# EAGLE design ESP32_Sparrow_rev2 (EAGLE 9.6.2)
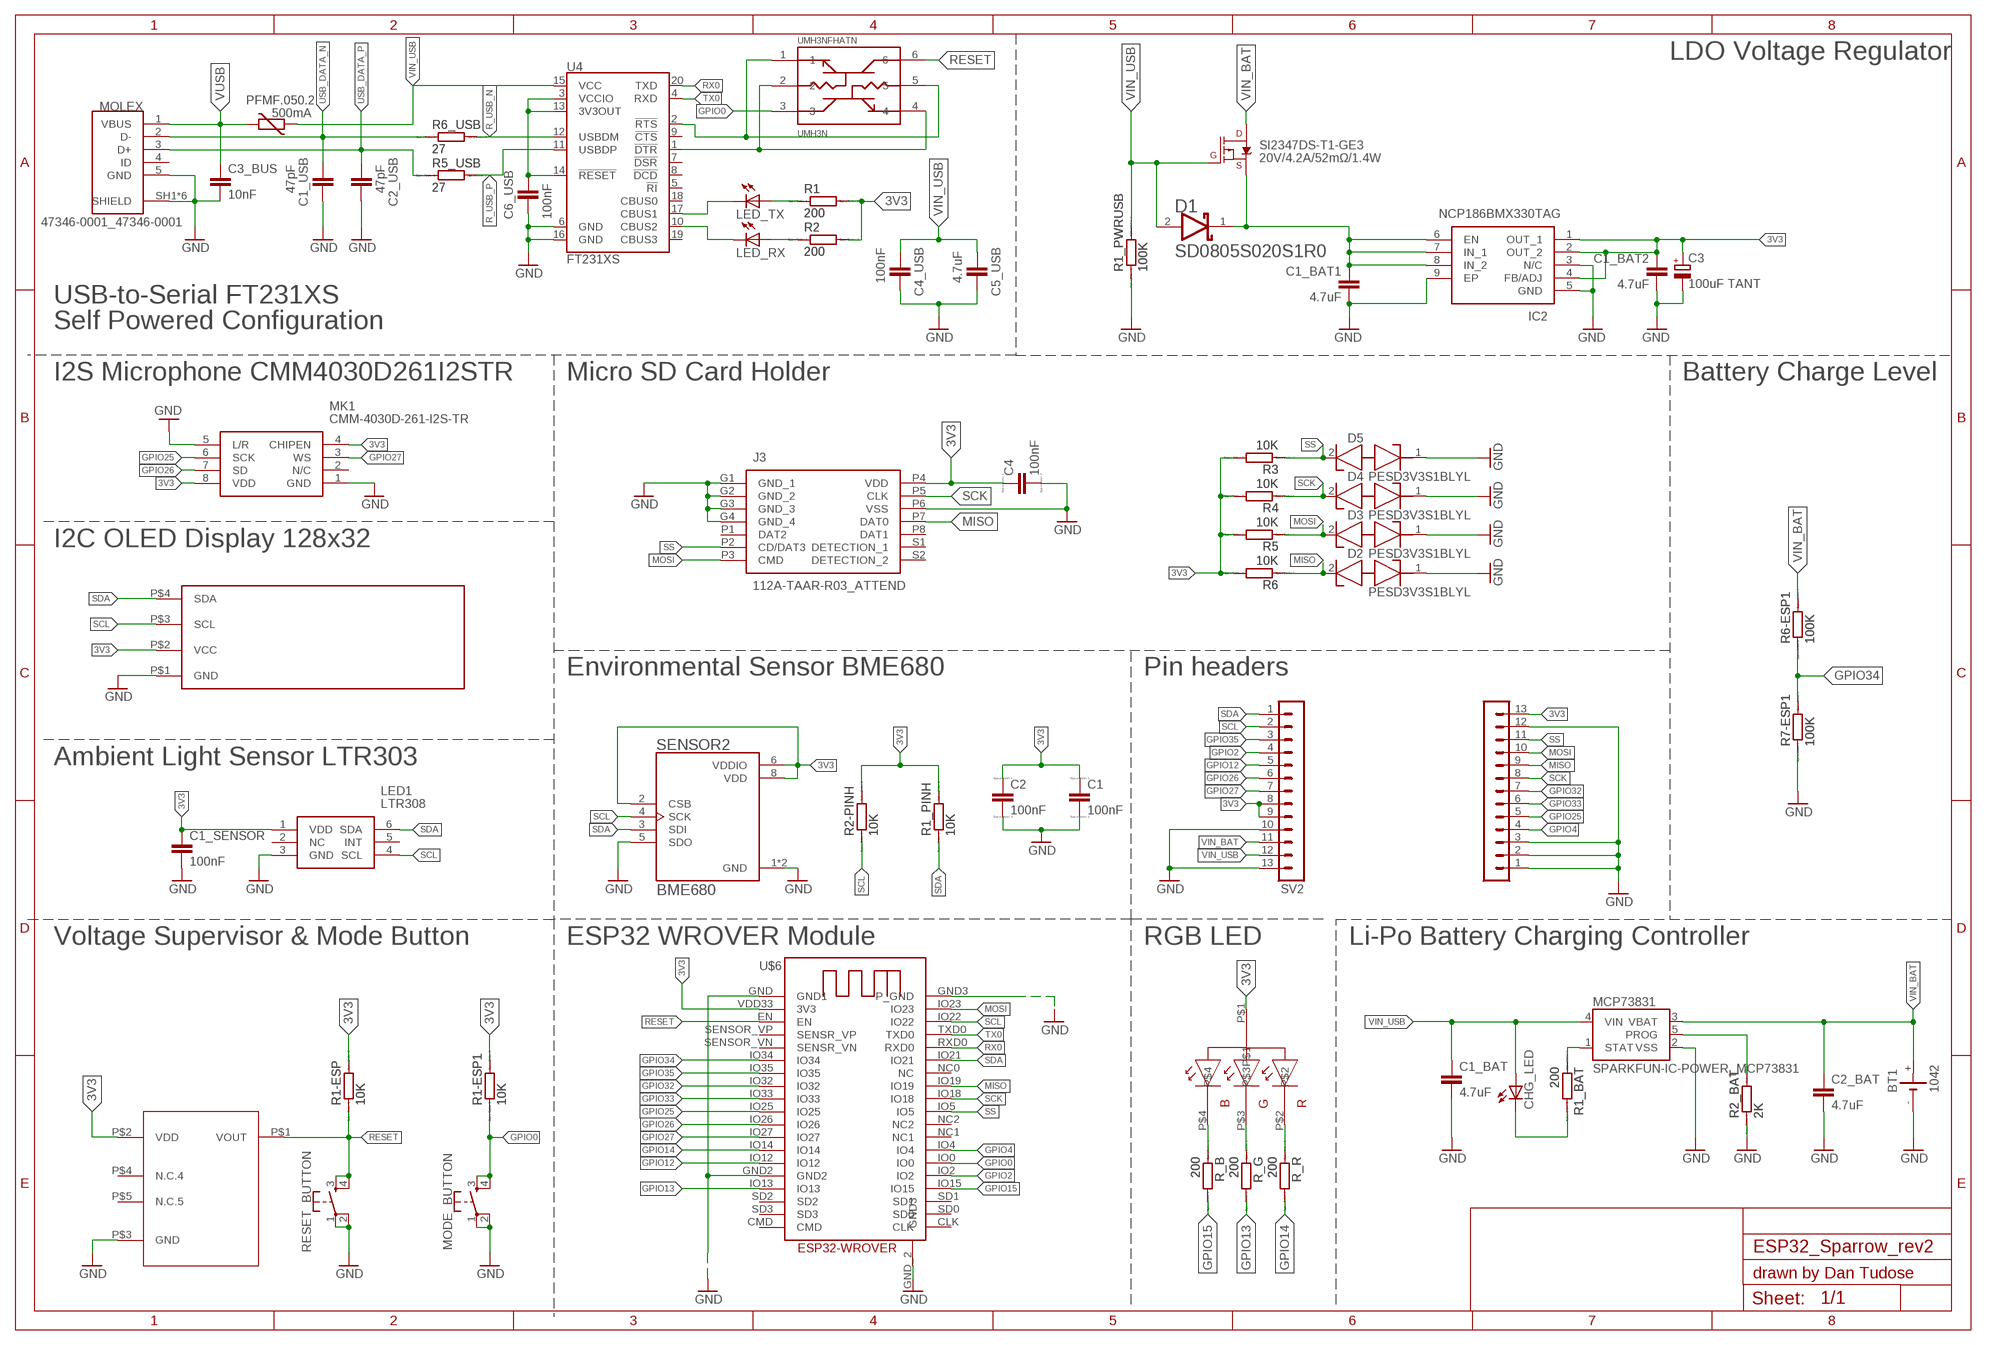
[diagram p0: schematic, sheet 1]

## Parts
BD48E27G-TR  BD48E27G-TR_BD48E27G-TR  [BD48E27G-TR_SSOP5]
BT1  1042  [BAT_1042]
C1  100nF  EAGLE-LTSPICE_CC0402  [EAGLE-LTSPICE_C0402]
C1_BAT  4.7uF  RCL_C-EUC0603  [RCL_C0603]
C1_BAT1  4.7uF  RCL_C-EUC0603  [RCL_C0603]
C1_BAT2  4.7uF  RCL_C-EUC0603  [RCL_C0603]
C1_SENSOR  100nF  RCL_C-EUC0603  [RCL_C0603]
C1_USB  47pF  RCL_C-EUC0603  [RCL_C0603]
C2  100nF  EAGLE-LTSPICE_CC0402  [EAGLE-LTSPICE_C0402]
C2_BAT  4.7uF  RCL_C-EUC0603  [RCL_C0603]
C2_USB  47pF  RCL_C-EUC0603  [RCL_C0603]
C3  100uF TANT  CPOL-EUCT3528  [CT3528]
C3_BUS  10nF  RCL_C-EUC0603  [RCL_C0603]
C4  100nF  EAGLE-LTSPICE_CC0402  [EAGLE-LTSPICE_C0402]
C4_USB  100nF  RCL_C-EUC0603  [RCL_C0603]
C5_USB  4.7uF  RCL_C-EUC0603  [RCL_C0603]
C6_USB  100nF  RCL_C-EUC0603  [RCL_C0603]
CHG_LED  ADAFRUIT_LEDCHIP-LED0603  [ADAFRUIT_CHIP-LED0603]
D1  AVX---SD0805S020S1R0_AVX_SD0805S020S1R0AVX_SD0805S020S1R0_0_0  [AVX---SD0805S020S1R0_AVX_SD0805S020S1R0_0]
D2  PESD3V3S1BLYL  [PESD5V0S1BL315]
D3  PESD3V3S1BLYL  [PESD5V0S1BL315]
D4  PESD3V3S1BLYL  [PESD5V0S1BL315]
D5  PESD3V3S1BLYL  [PESD5V0S1BL315]
IC2  NCP186BMX330TAG  [NCP186AMX330TAG]
J3  112A-TAAR-R03_ATTEND  [112ATAARR03ATTEND]
LED1  LTR308  SAMACSYS_PARTS_LTR-303ALS-01  [SAMACSYS_PARTS_LTR303ALS01]
LED_RX  ADAFRUIT_LEDCHIP-LED0603  [ADAFRUIT_CHIP-LED0603]
LED_TX  ADAFRUIT_LEDCHIP-LED0603  [ADAFRUIT_CHIP-LED0603]
MCP73831  SPARKFUN-IC-POWER_MCP73831  [SPARKFUN-IC-POWER_SOT23-5]
MK1  CMM-4030D-261-I2S-TR  [CMM4030D261I2STR]
MODE_BUTTON  SPARKFUN-SWITCHES_MOMENTARY-SWITCH-SPST-2-SMD-4.6X2.8MM  [SPARKFUN-SWITCHES_TACTILE_SWITCH_SMD_4.6X2.8MM]
MOLEX  47346-0001_47346-0001  [47346-0001_MOLEX_47346-0001]
PFMF.050.2  500mA  VARISTOR_VARISTORCN1812  [VARISTOR_CT/CN1812]
R1  200  EAGLE-LTSPICE_RR0402  [EAGLE-LTSPICE_R0402]
R1-ESP  10K  EAGLE-LTSPICE_RR0402  [EAGLE-LTSPICE_R0402]
R1-ESP1  10K  EAGLE-LTSPICE_RR0402  [EAGLE-LTSPICE_R0402]
R1_BAT  200  EAGLE-LTSPICE_RR0402  [EAGLE-LTSPICE_R0402]
R1_PINH  10K  EAGLE-LTSPICE_RR0402  [EAGLE-LTSPICE_R0402]
R1_PWRUSB  100K  EAGLE-LTSPICE_RR0402  [EAGLE-LTSPICE_R0402]
R2  200  EAGLE-LTSPICE_RR0402  [EAGLE-LTSPICE_R0402]
R2-PINH  10K  EAGLE-LTSPICE_RR0402  [EAGLE-LTSPICE_R0402]
R2_BAT  2K  EAGLE-LTSPICE_RR0402  [EAGLE-LTSPICE_R0402]
R3  10K  EAGLE-LTSPICE_RR0402  [EAGLE-LTSPICE_R0402]
R4  10K  EAGLE-LTSPICE_RR0402  [EAGLE-LTSPICE_R0402]
R5  10K  EAGLE-LTSPICE_RR0402  [EAGLE-LTSPICE_R0402]
R5_USB  27  EAGLE-LTSPICE_RR0402  [EAGLE-LTSPICE_R0402]
R6  10K  EAGLE-LTSPICE_RR0402  [EAGLE-LTSPICE_R0402]
R6-ESP1  100K  EAGLE-LTSPICE_RR0402  [EAGLE-LTSPICE_R0402]
R6_USB  27  EAGLE-LTSPICE_RR0402  [EAGLE-LTSPICE_R0402]
R7-ESP1  100K  EAGLE-LTSPICE_RR0402  [EAGLE-LTSPICE_R0402]
R_B  200  EAGLE-LTSPICE_RR0402  [EAGLE-LTSPICE_R0402]
R_G  200  EAGLE-LTSPICE_RR0402  [EAGLE-LTSPICE_R0402]
R_R  200  EAGLE-LTSPICE_RR0402  [EAGLE-LTSPICE_R0402]
RESET_BUTTON  SPARKFUN-SWITCHES_MOMENTARY-SWITCH-SPST-2-SMD-4.6X2.8MM  [SPARKFUN-SWITCHES_TACTILE_SWITCH_SMD_4.6X2.8MM]
SENSOR2  BME680  BME680_BME680  [BME680_PSON80P300X300X100-8N]
SI2347DS-T1-GE3  20V/4.2A/52mΩ/1.4W  SPARKFUN-DISCRETESEMI_MOSFET_PCH-DMG2305UX-7  [SPARKFUN-DISCRETESEMI_SOT23-3]
SV1  MA13-1  [MA13-1]
SV2  MA13-1  [MA13-1]
U4  FT231XS  SPARKFUN-IC-COMMS_FT231XS  [SPARKFUN-IC-COMMS_SSOP20_L]
U$1  OLED  [SIP]
U$2  150202M153130_150202M153130-RGB  [150202M153130_150202M153130]
U$6  ESP32-WROVER_ESP32-WROVER  [ESP32-WROVER_ESP32-WROVER]
UMH3NFHATN  UMH3N  UMH3N_UMH3N  [UMH3N_SOP65P210X100-6N]

## Nets
3V3: BD48E27G-TR.P$2(VDD) C1.1 C1_BAT2.1 C1_SENSOR.1 C2.1 C3.+ C4.1 IC2.1(OUT_1) IC2.2(OUT_2) IC2.4(FB/ADJ) J3.P4(VDD) LED1.1(VDD) MK1.4(CHIPEN) MK1.8(VDD) R1-ESP1.2 R1-ESP.2 R1.2 R1_PINH.2 R2-PINH.2 R2.2 R3.2 R4.2 R5.2 R6.2 SENSOR2.2(CSB) SENSOR2.6(VDDIO) SENSOR2.8(VDD) SV1.13 SV2.8 SV2.9 U$1.P$2(VCC) U$2.P$1 U$6.VDD33(3V3)
GND: BD48E27G-TR.P$3(GND) BT1.- C1.2 C1_BAT1.2 C1_BAT2.2 C1_BAT.2 C1_SENSOR.2 C1_USB.2 C2.2 C2_BAT.2 C2_USB.2 C3.- C3_BUS.2 C4.2 C4_USB.2 C5_USB.2 C6_USB.2 D2.1(K1) D3.1(K1) D4.1(K1) D5.1(K1) IC2.3(N/C) IC2.5(GND) IC2.9(EP) J3.G1(GND_1) J3.G2(GND_2) J3.G3(GND_3) J3.G4(GND_4) J3.P6(VSS) LED1.3(GND) MCP73831.2(VSS) MK1.1(GND) MK1.5(L/R) MODE_BUTTON.1 MODE_BUTTON.2 MOLEX.5(GND) MOLEX.SH1(SHIELD) MOLEX.SH2(SHIELD) MOLEX.SH3(SHIELD) MOLEX.SH4(SHIELD) MOLEX.SH5(SHIELD) MOLEX.SH6(SHIELD) R1_PWRUSB.1 R2_BAT.1 R7-ESP1.1 RESET_BUTTON.1 RESET_BUTTON.2 SENSOR2.1(GND) SENSOR2.5(SDO) SENSOR2.7(GND) SV1.1 SV1.2 SV1.3 SV1.12 SV2.10 SV2.13 U4.6(GND) U4.16(GND) U$1.P$1(GND) U$6.GND2 U$6.GND3(P_GND) U$6.GND(GND1) U$6.GND_2(GND3)
GPIO0: MODE_BUTTON.3 MODE_BUTTON.4 R1-ESP1.1 U$6.IO0 UMH3NFHATN.3
GPIO2: SV2.4 U$6.IO2
GPIO4: SV1.4 U$6.IO4
GPIO12: SV2.5 U$6.IO12
GPIO13: R_G.2 U$6.IO13
GPIO14: R_R.2 U$6.IO14
GPIO15: R_B.2 U$6.IO15
GPIO25: MK1.6(SCK) SV1.5 U$6.IO25
GPIO26: MK1.7(SD) SV2.6 U$6.IO26
GPIO27: MK1.3(WS) SV2.7 U$6.IO27
GPIO32: SV1.7 U$6.IO32
GPIO33: SV1.6 U$6.IO33
GPIO34: R6-ESP1.1 R7-ESP1.2 U$6.IO34
GPIO35: SV2.3 U$6.IO35
MISO: D2.2(K2) J3.P7(DAT0) R6.1 SV1.9 U$6.IO19
MOSI: D3.2(K2) J3.P3(CMD) R5.1 SV1.10 U$6.IO23
N$2: C1_BAT1.1 D1.1(CATHODE) IC2.6(EN) IC2.7(IN_1) IC2.8(IN_2) SI2347DS-T1-GE3.2(S)
N$5: MCP73831.1(STAT) R1_BAT.1
N$6: CHG_LED.C R1_BAT.2
N$7: MCP73831.5(PROG) R2_BAT.2
N$8: R_R.1 U$2.P$2
N$10: R_G.1 U$2.P$3
N$11: R_B.1 U$2.P$4
N$15: C6_USB.1 U4.3(VCCIO) U4.13(3V3OUT) U4.14(!RESET)
N$17: LED_TX.A R1.1
N$18: LED_RX.A R2.1
N$20: U4.1(!DTR) UMH3NFHATN.2 UMH3NFHATN.4
N$21: LED_TX.C U4.17(CBUS1)
N$23: LED_RX.C U4.10(CBUS2)
N$24: U4.2(!RTS) UMH3NFHATN.1 UMH3NFHATN.5
R_USB_N: R6_USB.2 U4.12(USBDM)
R_USB_P: R5_USB.2 U4.11(USBDP)
RESET: BD48E27G-TR.P$1(VOUT) R1-ESP.1 RESET_BUTTON.3 RESET_BUTTON.4 U$6.EN UMH3NFHATN.6
RX0: U4.20(TXD) U$6.RXD0
SCK: D4.2(K2) J3.P5(CLK) R4.1 SV1.8 U$6.IO18
SCL: LED1.4(SCL) R2-PINH.1 SENSOR2.4(SCK) SV2.2 U$1.P$3(SCL) U$6.IO22
SDA: LED1.6(SDA) R1_PINH.1 SENSOR2.3(SDI) SV2.1 U$1.P$4(SDA) U$6.IO21
SS: D5.2(K2) J3.P2(CD/DAT3) R3.1 SV1.11 U$6.IO5
TX0: U4.4(RXD) U$6.TXD0
USB_DATA_N [RES_DIFF]: C1_USB.1 MOLEX.2(D-) R6_USB.1
USB_DATA_P [RES_DIFF]: C2_USB.1 MOLEX.3(D+) R5_USB.1
VIN_BAT: BT1.+ C2_BAT.1 MCP73831.3(VBAT) R6-ESP1.2 SI2347DS-T1-GE3.3(D) SV2.11
VIN_USB: C1_BAT.1 C4_USB.1 C5_USB.1 CHG_LED.A D1.2(ANODE) MCP73831.4(VIN) PFMF.050.2.1 R1_PWRUSB.2 SI2347DS-T1-GE3.1(G) SV2.12 U4.15(VCC)
VUSB: C3_BUS.1 MOLEX.1(VBUS) PFMF.050.2.2
Unconnected: BD48E27G-TR.P$4(N.C.4) BD48E27G-TR.P$5(N.C.5) J3.P1(DAT2) J3.P8(DAT1) J3.S1(DETECTION_1) J3.S2(DETECTION_2) LED1.2(NC) LED1.5(INT) MK1.2(N/C) MOLEX.4(ID) U4.5(!RI) U4.7(!DSR) U4.8(!DCD) U4.9(!CTS) U4.18(CBUS0) U4.19(CBUS3) U$6.CLK U$6.CMD U$6.NC0(NC) U$6.NC1 U$6.NC2 U$6.SD0 U$6.SD1 U$6.SD2 U$6.SD3 U$6.SENSOR_VN(SENSR_VN) U$6.SENSOR_VP(SENSR_VP)

## Notes on the sheet
- LDO Voltage Regulator
- USB-to-Serial FT231XS
- Self Powered Configuration
- I2S Microphone CMM4030D261I2STR | Micro SD Card Holder | Battery Charge Level
- I2C OLED Display 128x32
- Environmental Sensor BME680 | Pin headers
- Ambient Light Sensor LTR303
- Voltage Supervisor & Mode Button | ESP32 WROVER Module | RGB LED | Li-Po Battery Charging Controller
- drawn by Dan Tudose

## Library data of the parts
BD48E27G-TR = ESP32_WROVER:BD48E27G-TR_BD48E27G-TR
BT1 = 1042:1042: Lithium-Ion Battery Holder, 1 Cell, Plastic UL 94V-O, SMT Check availability <https://pricing.snapeda.com/parts/1042/Keystone%20Electronics%20Corp./view-part?ref=eda>; AVAILABILITY: In Stock; DESCRIPTION: SMT Holder for 18650 Battery; MF: Keystone Electronics Corp.; MP: 1042; PACKAGE: None; PRICE: None; PURCHASE-URL: https://pricing.snapeda.com/search/part/1042/?ref=eda
C1 C2 C4 = ESP32_WROVER:EAGLE-LTSPICE_C: CAPACITOR, European symbol; SPICEMODEL: NONE; SPICEPREFIX: C
C1_BAT C1_BAT1 C1_BAT2 C1_SENSOR C1_USB C2_BAT C2_USB C3_BUS C4_USB C5_USB C6_USB = ESP32_WROVER:RCL_C-EU: CAPACITOR, European symbol; SPICEPREFIX: C
C3 = rcl:CPOL-EU: POLARIZED CAPACITOR, European symbol; SPICEPREFIX: C
CHG_LED LED_RX LED_TX = ESP32_WROVER:ADAFRUIT_LED: LED OSRAM: - CHIPLED LG R971, LG N971, LY N971, LG Q971, LY Q971, LO R971, LY R971 LH N974, LH R974 LS Q976, LO Q976, LY Q976 LO Q996 - Hyper CHIPLED LW Q18S LB Q993, LB Q99A, LB R99A - SideLED LS A670, LO A670, LY A670, LG A670, LP A670 LB A673, LV A673, LT A673, LW A673 LH A674 LY A675 LS A676, LA A676, LO A676, LY A676, LW A676 LS A679, LY A679, LG A679 - Hyper Micro SIDELED® LS Y876, LA Y876, LO Y876, LY Y876 LT Y87S - SmartLED LW L88C, LW L88S LB L89C, LB L89S, LG L890 LS L89K, LO L89K, LY L89K LS L896, LA L896, LO L896, LY L896 - TOPLED LS T670, LO T670, LY T670, LG T670, LP T670 LSG T670, LSP T670, LSY T670, LOP T670, LYG T670 LG T671, LOG T671, LSG T671 LB T673, LV T673, LT T673, LW T673 LH T674 LS T676, LA T676, LO T676, LY T676, LB T676, LH T676, LSB T676, LW T676 LB T67C, LV T67C, LT T67C, LS T67K, LO T67K, LY T67K, LW E67C LS E67B, LA E67B, LO E67B, LY E67B, LB E67C, LV E67C, LT E67C LW T67C LS T679, LY T679, LG T679 LS T770, LO T770, LY T770, LG T770, LP T770 LB T773, LV T773, LT T773, LW T773 LH T774 LS E675, LA E675, LY E675, LS T675 LS T776, LA T776, LO T776, LY T776, LB T776 LHGB T686 LT T68C, LB T68C - Hyper Mini TOPLED® LB M676 - Mini TOPLED Santana® LG M470 LS M47K, LO M47K, LY M47K Source: http://www.osram.convergy.de/
D1 = ESP32_WROVER:AVX---SD0805S020S1R0_AVX_SD0805S020S1R0: Schottky Barrier Rectifier Diode; CENTROID_NOT_SPECIFIED: No; DATASHEET: http://datasheets.avx.com/schottky.pdf; DIGIKEY_DESCRIPTION: DIODE SCHOTTKY 20V 1A 0805; DIGIKEY_PART_NUMBER: 478-7800-1-ND; LEAD_FREE: yes; MF: AVX; MOUSER_PART_NUMBER: 581-SD0805S020S1R0; MPN: SD0805S020S1R0; PACKAGE: 0805 (2012 metric); PREFIX: D; ROHS: yes; TEMPERATURE_RANGE_HIGH: +125°C; TEMPERATURE_RANGE_LOW: -55°C
D2-D5 = SamacSys_Parts:PESD3V3S1BLYL: PESD3V3S1BL - Low capacitance bidirectional ESD protection diode Source: Datasheet <https://assets.nexperia.com/documents/data-sheet/PESD3V3S1BL.pdf>; ARROW_PART_NUMBER: PESD3V3S1BLYL; ARROW_PRICE-STOCK: https://www.arrow.com/en/products/pesd3v3s1blyl/nexperia?region=nac; DESCRIPTION: PESD3V3S1BL - Low capacitance bidirectional ESD protection diode; HEIGHT: 0mm; MANUFACTURER_NAME: Nexperia; MANUFACTURER_PART_NUMBER: PESD3V3S1BLYL; MOUSER_PART_NUMBER: 771-PESD3V3S1BLYL; MOUSER_PRICE-STOCK: https://www.mouser.co.uk/ProductDetail/Nexperia/PESD3V3S1BLYL?qs=vLWxofP3U2zWoKHYJMVoKQ%3D%3D
IC2 = SamacSys_Parts:NCP186BMX330TAG: LDO Voltage Regulators FAST TRANSIENT RESPO Source: Datasheet <http://www.onsemi.com/pub/Collateral/NCP186-D.PDF>; ARROW_PART_NUMBER: NCP186BMX330TAG; ARROW_PRICE-STOCK: https://www.arrow.com/en/products/ncp186bmx330tag/on-semiconductor?region=nac; DESCRIPTION: LDO Voltage Regulators FAST TRANSIENT RESPO; HEIGHT: mm; MANUFACTURER_NAME: onsemi; MANUFACTURER_PART_NUMBER: NCP186BMX330TAG; MOUSER_PART_NUMBER: 863-NCP186BMX330TAG; MOUSER_PRICE-STOCK: https://www.mouser.co.uk/ProductDetail/onsemi/NCP186BMX330TAG?qs=tCMd4XlZ%2FiDuLBXmI4EY0w%3D%3D
J3 = SamacSys_Parts:112A-TAAR-R03_ATTEND: Micro SD Card Socket, Push-Push Type, Top Mount, SMT, H=1.83mm, 10u Source: Datasheet <https://www.attend.com.tw/data/download/file/112A-TAAR-R03.pdf>; DESCRIPTION: Micro SD Card Socket, Push-Push Type, Top Mount, SMT, H=1.83mm, 10u; HEIGHT: 1.9mm; MANUFACTURER_NAME: ATTEND; MANUFACTURER_PART_NUMBER: 112A-TAAR-R03 ATTEND
LED1 = ESP32_WROVER:SAMACSYS_PARTS_LTR-303ALS-01: Ambient Light Sensors Ambient Light Photo Sensor Source: Datasheet <http://optoelectronics.liteon.com/upload/download/DS86-2013-0004/LTR-303ALS-01_DS_V1.pdf>; ARROW_PART_NUMBER: LTR-303ALS-01; ARROW_PRICE-STOCK: https://www.arrow.com/en/products/ltr-303als-01/lite-on-technology?region=nac; DESCRIPTION: Ambient Light Sensors Ambient Light Photo Sensor; HEIGHT: 0mm; MANUFACTURER_NAME: Lite-On; MANUFACTURER_PART_NUMBER: LTR-303ALS-01; MOUSER_PART_NUMBER: 859-LTR-303ALS-01; MOUSER_PRICE-STOCK: https://www.mouser.co.uk/ProductDetail/Lite-On/LTR-303ALS-01?qs=Ml%2FaxAEbwm%252Bm%252BetMkBDC8g%3D%3D
MCP73831 = ESP32_WROVER:SPARKFUN-IC-POWER_MCP73831: MCP73831T Li-Ion, Li-Pol Controller Miniature single cell, fully integrated Li-Ion, Li-polymer charge management controller Datasheet <http://ww1.microchip.com/downloads/en/DeviceDoc/20001984g.pdf> SparkFun Products: SparkFun ESP32 Thing <https://www.sparkfun.com/products/13907> SparkFun 9DoF Razor IMU M0 <https://www.sparkfun.com/products/14001>; PROD_ID: IC-09995
MK1 = SamacSys_Parts:CMM-4030D-261-I2S-TR: MEMS Microphones Microphone, 4mm x 3mm x1.25mm deep, MEMs,omnidirectional, SMT, digital, I2S, 1.8V, T&R Source: Datasheet <https://www.mouser.co.uk/datasheet/2/670/cmm_4030d_261_i2s_tr-1892247.pdf>; DESCRIPTION: MEMS Microphones Microphone, 4mm x 3mm x1.25mm deep, MEMs,omnidirectional, SMT, digital, I2S, 1.8V, T&R; HEIGHT: 1.35mm; MANUFACTURER_NAME: CUI Inc.; MANUFACTURER_PART_NUMBER: CMM-4030D-261-I2S-TR; MOUSER_PART_NUMBER: 490-CMM4030D261I2STR; MOUSER_PRICE-STOCK: https://www.mouser.co.uk/ProductDetail/CUI-Devices/CMM-4030D-261-I2S-TR?qs=hWgE7mdIu5S0cyoxFo6Z3Q%3D%3D
MODE_BUTTON RESET_BUTTON = ESP32_WROVER:SPARKFUN-SWITCHES_MOMENTARY-SWITCH-SPST-2: Momentary Switch (Pushbutton) - SPST - Two Circuits Normally-open (NO) SPST momentary switches (buttons, pushbuttons). Schematic symbol includes two switch circuits. Variants SMD-4.6MMX2.8MM - 4.60mm x 2.80mm Tactile Momentary Button Switch - Used on SparkFun SAMD21 Mini Breakout <https://www.sparkfun.com/products/13664> SMD-5.2MM - Mini Pushbutton Switch - SMD <https://www.sparkfun.com/products/8720> - Used on Arduino Pro Mini <https://www.sparkfun.com/products/11114>; PROD_ID: SWCH-14139; SF_SKU: COM-08720
MOLEX = ESP32_WROVER:47346-0001_47346-0001: CONN RCPT 5POS MICRO USB R/A SMD Check prices <https://pricing.snapeda.com/parts/47346-0001/Molex/view-part?ref=eda>; AVAILABILITY: Warning; DESCRIPTION: USB - micro B USB 2.0 Receptacle Connector 5 Position Surface Mount, Right Angle; MF: Molex; MP: 47346-0001; PACKAGE: None; PRICE: None
PFMF.050.2 = ESP32_WROVER:VARISTOR_VARISTOR: VARISTOR
R1 R1-ESP R1_BAT R1_PINH R1_PWRUSB R2 R2-PINH R3-R5 R5_USB R6 R6-ESP1 R6_USB R7-ESP1 R_B R_G R_R = ESP32_WROVER:EAGLE-LTSPICE_R*?: RESISTOR, European symbol; SPICEMODEL: NONE; SPICEPREFIX: R
R1-ESP1 R2_BAT = ESP32_WROVER:EAGLE-LTSPICE_R: RESISTOR, European symbol; SPICEMODEL: NONE; SPICEPREFIX: R
SENSOR2 = ESP32_WROVER:BME680_BME680: Integrated Environmental Unit; AVAILABILITY: Unavailable; DESCRIPTION: Integrated Environmental Unit; MF: Bosch Sensortec; MP: BME680; PACKAGE: LGA-8 Bosch Tools; PRICE: None
SI2347DS-T1-GE3 = ESP32_WROVER:SPARKFUN-DISCRETESEMI_MOSFET_PCH: P-channel MOSFETs Voltage controlled devices that allow control of high current outputs. SparkFun Products: SparkFun ESP32 Thing <https://www.sparkfun.com/products/13907> SparkFun ESP8266 Thing <https://www.sparkfun.com/products/13231> SparkFun Pi Servo HAT V2 <https://www.sparkfun.com/products/15316> DMG2305UX-7 (20V/4.2A/SOT23-3); PROD_ID: TRAN-14388
SV1 SV2 = con-lstb:MA13-1: PIN HEADER; OC_FARNELL: unknown; OC_NEWARK: unknown
U4 = ESP32_WROVER:SPARKFUN-IC-COMMS_FT231X: FTDI FT231X Full Speed USB to Full-handshake UART This USB2.0 Full Speed IC offers a compact bridge to full handshake UART interfaces. The device is a UART, capable of operating up to 3MBaud, with low power consumption (8mA). The FT231X includes the complete FT-X series feature set and enables USB to be added into a system design quickly and easily over a UART interface. Datasheet <http://cdn.sparkfun.com/datasheets/Components/General%20IC/DS_FT231X.pdf> SparkFun Products SparkFun RedBoard - Programmed with Arduino <https://www.sparkfun.com/products/12757> (DEV-12757) SparkFun XBee Explorer USB <https://www.sparkfun.com/products/11812> (WRL-11812) SparkFun XBee Explorer Dongle <https://www.sparkfun.com/products/11697> (WRL-11697) SparkFun Blynk Board - ESP8266 <https://www.sparkfun.com/products/13794> (WRL-13794) SparkFun ESP8266 Thing - Dev Board <https://www.sparkfun.com/products/13711> (WRL-13711) SparkFun Block for Intel® Edison - Base <https://www.sparkfun.com/products/13045> (DEV-13045) SparkFun RedStick <https://www.sparkfun.com/products/13741> (DEV-13741) SparkFun Beefy 3 - FTDI Basic Breakout <https://www.sparkfun.com/products/13746> (DEV-13746) SparkFun FT231X Breakout <https://www.sparkfun.com/products/11736> (BOB-11736); PROD_ID: IC-11524
U$1 = OLED:OLED: I2C 0.91"128x32 OLED
U$2 = ESP32_WROVER:150202M153130_150202M153130-RGB
U$6 = ESP32_WROVER:ESP32-WROVER_ESP32-WROVER
UMH3NFHATN = ESP32_WROVER:UMH3N_UMH3N: Dual PNP/NPN transistor for chip reset; AVAILABILITY: Unavailable; DESCRIPTION: Pre-Biased Bipolar Transistor (BJT) 2 NPN - Pre-Biased (Dual) 50V 100mA 250MHz 150mW Surface Mount UMT6; MF: Rohm; MP: UMH3N; PACKAGE: SOT-363 Rohm; PRICE: None

## Board
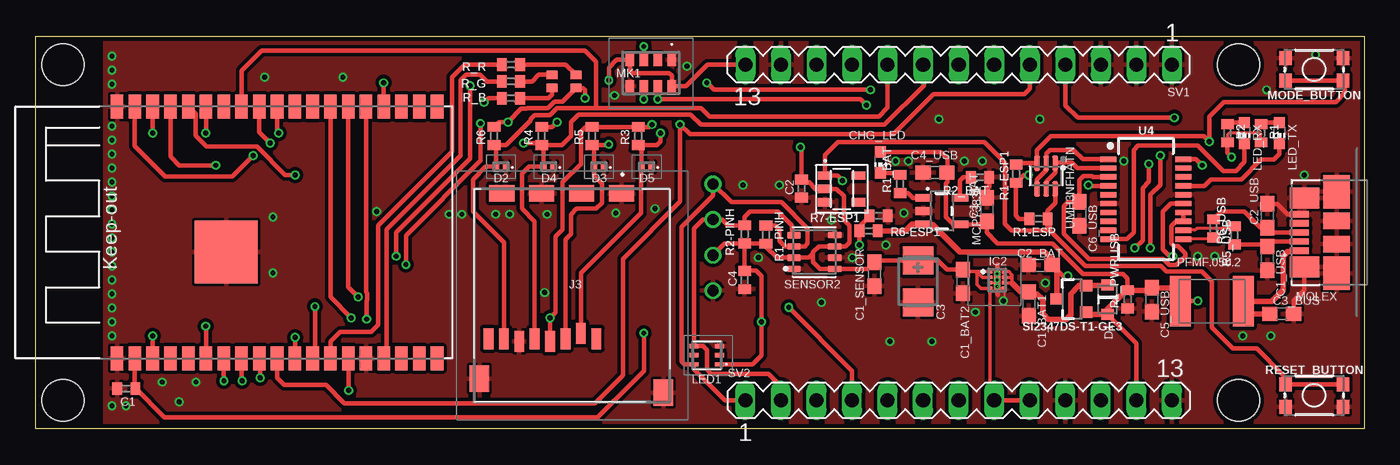
[diagram p1: board, top side]
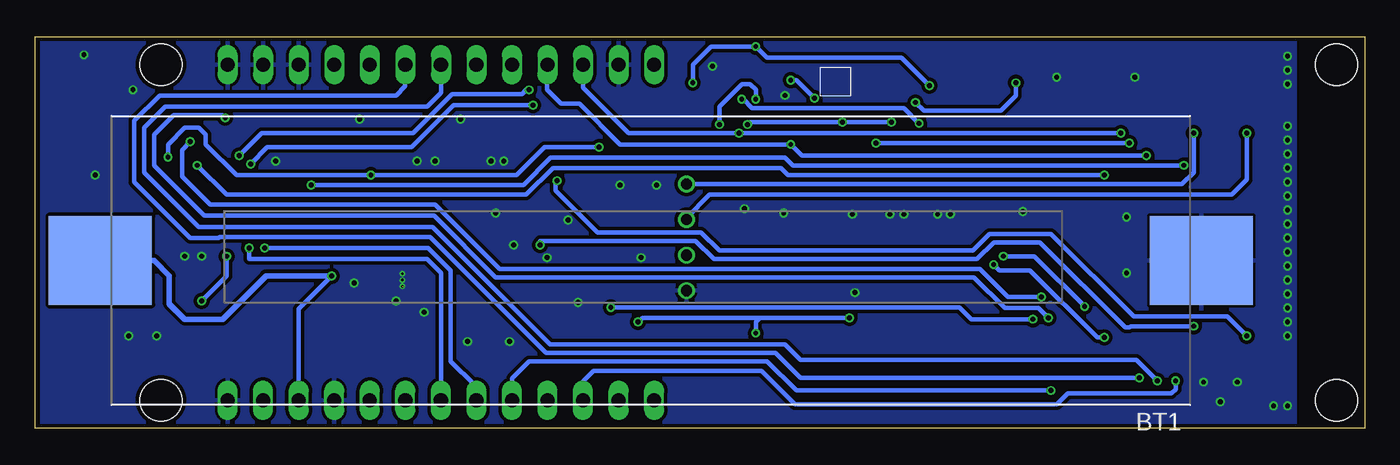
[diagram p2: board, bottom side, seen from below]

Size 95 x 28 mm. Coordinates in mm from the lower left corner, seen from the top.
Outline: 0,0 95,0 95,28 0,28 0,0
Copper layers (1*16): Top 0.035mm / dielectric 1.5mm / Bottom 0.035mm
Design rules "PCB-POOL Standard *": minimum track width 0.15mm, minimum drill 0.3mm, track to track 0.15mm, track to pad 0.15mm, pad to pad 0.15mm, via to via 0.15mm, smd to smd 0.15mm, copper to edge 0.3mm, drill to drill 0.2mm, minimum pad ring 0.2mm, minimum via ring 0.1mm, stop-mask expansion 0.03mm, vias tented up to drill 20mil, thermal gap 0.2mm
Holes 3 mm at 2,2 2,26 86,2 86,26

### Footprints (pad centres in the part's own frame; a part is rotated, then mirrored left to right if it is on the bottom)
BD48E27G-TR_SSOP5 = smd 0.6 x 1: P$1 -0.95,-0.8; P$2 0,-0.8; P$3 0.95,-0.8; P$4 0.95,1.6; P$5 -0.95,1.6
BAT_1042 = smd 7.35 x 6.35: + 39.33,0; - -39.33,0
EAGLE-LTSPICE_C0402 = smd 0.7 x 0.9: 1 -0.65,0; 2 0.65,0
RCL_C0603 = smd 1.1 x 1: 1 -0.85,0; 2 0.85,0
CT3528 = smd 2 x 2.2: + -1.5,0; - 1.5,0
ADAFRUIT_CHIP-LED0603 = smd 0.8 x 0.8: A 0,-0.75; C 0,0.75
AVX---SD0805S020S1R0_AVX_SD0805S020S1R0_0 = smd 0.8 x 0.9: 1 -1.05,0; 2 1.05,0
PESD5V0S1BL315 = smd 0.4 x 0.7: 1 -0.35,0; 2 0.35,0
NCP186AMX330TAG = smd 0.26 x 0.35: 1 -0.6,-0.275; 2 -0.2,-0.275; 3 0.2,-0.275; 4 0.6,-0.275; 5 0.6,0.775; 6 0.2,0.775; 7 -0.2,0.775; 8 -0.6,0.775 | smd 1.44 x 0.44: 9 0,0.25
112ATAARR03ATTEND = smd 1.8 x 1.2: G1 10.6,10.4; G2 4.9,10.4; S1 7.75,10.4; S2 2.05,10.4 | smd 1.4 x 1.9: G3 13.6,-3.85; G4 0.45,-2.85 | smd 0.7 x 1.5: P1 8.8,0; P2 7.7,0.4; P3 6.6,0; P4 5.5,-0.2; P5 4.4,0; P6 3.3,-0.2; P7 2.2,0; P8 1.1,0
SAMACSYS_PARTS_LTR303ALS01 = smd 0.3 x 0.65: 1 -0.65,-0.9; 2 0,-0.9; 3 0.65,-0.9; 4 0.65,0.9; 5 0,0.9; 6 -0.65,0.9
SPARKFUN-IC-POWER_SOT23-5 = smd 0.55 x 1.2: 1 -0.95,-1.3; 2 0,-1.3; 3 0.95,-1.3; 4 0.95,1.3; 5 -0.95,1.3
CMM4030D261I2STR = smd 0.9 x 0.6: 1 0.95,-1.5; 2 0.95,-0.5; 3 0.95,0.5; 4 0.95,1.5; 5 -0.95,1.5; 6 -0.95,0.5; 7 -0.95,-0.5; 8 -0.95,-1.5
SPARKFUN-SWITCHES_TACTILE_SWITCH_SMD_4.6X2.8MM = smd 0.9 x 1: 1 -2.05,-0.8; 2 2.05,-0.8; 3 2.05,0.8; 4 -2.05,0.8
47346-0001_MOLEX_47346-0001 = smd 0.45 x 1.38: 1 -1.3,2.66; 2 -0.65,2.66; 3 0,2.66; 4 0.65,2.66; 5 1.3,2.66 | smd 1.475 x 2.1: SH1 -2.462,2.3; SH2 2.462,2.3 | smd 2.375 x 1.9: SH3 -2.913,0; SH6 2.913,0 | smd 1.175 x 1.9: SH4 -0.838,0; SH5 0.838,0
VARISTOR_CT/CN1812 = smd 1.5 x 3.6: 1 -2.25,0; 2 2.25,0
EAGLE-LTSPICE_R0402 = smd 0.7 x 0.9: 1 -0.65,0; 2 0.65,0
BME680_PSON80P300X300X100-8N = smd 1.016 x 0.5: 1 1.458,1.2; 2 1.458,0.4; 3 1.458,-0.4; 4 1.458,-1.2; 5 -1.458,-1.22; 6 -1.458,-0.4; 7 -1.458,0.4; 8 -1.458,1.2
SPARKFUN-DISCRETESEMI_SOT23-3 = smd 0.8 x 0.9: 1 -0.95,-1; 2 0.95,-1; 3 0,1.1
MA13-1 = drill 1.016 long: 1 -15.24,0; 2 -12.7,0; 3 -10.16,0; 4 -7.62,0; 5 -5.08,0; 6 -2.54,0; 7 0,0; 8 2.54,0; 9 5.08,0; 10 7.62,0; 11 10.16,0; 12 12.7,0; 13 15.24,0
SPARKFUN-IC-COMMS_SSOP20_L = smd 0.381 x 1.143: 1 -2.857,-2.68; 2 -2.223,-2.68; 3 -1.587,-2.68; 4 -0.953,-2.68; 5 -0.318,-2.68; 6 0.318,-2.68; 7 0.953,-2.68; 8 1.587,-2.68; 9 2.223,-2.68; 10 2.857,-2.68; 11 2.857,2.68; 12 2.223,2.68; 13 1.587,2.68; 14 0.953,2.68; 15 0.318,2.68; 16 -0.318,2.68; 17 -0.953,2.68; 18 -1.587,2.68; 19 -2.223,2.68; 20 -2.857,2.68
SIP = drill 0.8: P$1 -17.55,-4.16; P$2 -17.55,-1.62; P$3 -17.55,0.92; P$4 -17.55,3.46
150202M153130_150202M153130 = smd 0.8 x 0.6: P$1 -0.85,0.475; P$2 -0.85,-0.475; P$3 0.85,-0.475; P$4 0.85,0.475
ESP32-WROVER_ESP32-WROVER = smd 1.7 x 0.9: CLK 18,1.27; CMD 0,1.27; EN 0,21.59; GND 0,24.13; GND3 18,24.13; GND_2 0,6.35; IO0 18,7.62; IO2 18,6.35; IO4 18,8.89; IO5 18,12.7; IO12 0,7.62; IO13 0,5.08; IO14 0,8.89; IO15 18,5.08; IO18 18,13.97; IO19 18,15.24; IO21 18,17.78; IO22 18,21.59; IO23 18,22.86; IO25 0,12.7; IO26 0,11.43; IO27 0,10.16; IO32 0,15.24; IO33 0,13.97; IO34 0,17.78; IO35 0,16.51; NC0 18,16.51; NC1 18,10.16; NC2 18,11.43; RXD0 18,19.05; SD0 18,2.54; SD1 18,3.81; SD2 0,3.81; SD3 0,2.54; SENSOR_VN 0,19.05; SENSOR_VP 0,20.32; TXD0 18,20.32; VDD33 0,22.86 | smd 4.5 x 4.5: GND2 7.62,16.34
UMH3N_SOP65P210X100-6N = smd 1.09 x 0.4: 1 -0.92,0.65; 2 -0.92,0; 3 -0.92,-0.65; 4 0.92,-0.65; 5 0.92,0; 6 0.92,0.65

### Placement (x,y rotation side)
BD48E27G-TR  57.25,17.12 270 top
BT1  51,12 180 bottom
C1  6.54,2.85 180 top
C1_BAT  68.01,15.64 90 top
C1_BAT1  71,8.9 270 top
C1_BAT2  66.3,10.5 270 top
C1_SENSOR  59.98,11.02 270 top
C1_USB  88.05,12.15 270 top
C2  54.77,17.14 270 top
C2_BAT  71.83,11.66 180 top
C2_USB  88.05,15.2 90 top
C3  63.1,10.5 270 top
C3_BUS  89.08,8.19 0 top
C4  50.7,10.6 270 top
C4_USB  64.31,18.28 180 top
C5_USB  79.79,9.2 270 top
C6_USB  74.64,15.34 270 top
CHG_LED  60.42,19.01 180 top
D1  76.63,9.2 270 top
D2  33.3,18.7 180 top
D3  40.3,18.7 180 top
D4  36.7,18.7 180 top
D5  43.7,18.7 180 top
IC2  68.5,10.6 270 top
J3  31.3,6.4 0 top
LED1  48,5.23 90 top
LED_RX  86.4,21.1 180 top
LED_TX  88.9,21.1 180 top
MCP73831  64.8,15.53 270 top
MK1  44,25.4 90 top
MODE_BUTTON  91.4,25.65 180 top
MOLEX  93,14 90 top
PFMF.050.2  84.08,9.08 0 top
R1  87.6,21.1 270 top
R1-ESP  71.7,14.98 180 top
R1-ESP1  70.11,18.2 270 top
R1_BAT  61.81,17.48 90 top
R1_PINH  52.23,13.85 270 top
R1_PWRUSB  78.07,9.22 90 top
R2  85.2,21.1 270 top
R2-PINH  50.71,13.87 270 top
R2_BAT  67.53,17.95 180 top
R3  43.1,20.9 90 top
R4  36.2,20.9 90 top
R5  39.8,20.9 90 top
R5_USB  84.2,14.3 270 top
R6  32.8,20.9 90 top
R6-ESP1  59.56,14.11 0 top
R6_USB  85.7,13.8 90 top
R7-ESP1  60.28,15.19 180 top
R_B  34,23.6 180 top
R_G  34,24.8 180 top
R_R  34,26 180 top
RESET_BUTTON  91.4,2.35 0 top
SENSOR2  55.69,12.6 180 top
SI2347DS-T1-GE3  74.12,9.25 90 top
SV1  66,26 180 top
SV2  66,2 0 top
U4  79.38,16.39 270 top
U$1  66,14 0 top
U$2  37.8,24.8 180 top
U$6  30,5 90 top
UMH3NFHATN  72.25,18.04 270 top

### Tracks (layer width: path | path; a pad name or v marks a point on that pad's centre or on a via)
3V3  (via drill 0.35)
  Top 0.2: R1.2 87.6,21 87.5,21.1 85.3,21.1 85.2,21 R2.2
  Top 0.254: IC2.1 67.3,11.2 | 67.3,11.2 66.45,11.2 C1_BAT2.1 | IC2.2 67.7,10.8 67.3,11.2 | 67.3,11.2 67.3,10.3 67.6,10 IC2.4 68.22,2.31 SV2.8
  Top 0.305: R1-ESP.2 70.32,14.98 70.1,15.2 R1-ESP1.2 70.66,18.1 v71,18.1 | R2-PINH.2 C4.1 50.75,11.3 51.5,11.3 51.9,10.9 v51.9,7.6 51.9,5.2 51.28,4.58 LED1.1 | R2-PINH.2 52.21,13.22 R1_PINH.2 52.23,12.97 53,12.2 SENSOR2.2 55.3,12.2 55.6,12.5 | C1_BAT2.1 65.15,11.35 64.5,12 C3.+ 60.11,12 C1_SENSOR.1 59.51,11.4 SENSOR2.8 56.1,11.4 55.6,11.9 55.6,12.5 | 55.6,12.5 55.6,12.6 56,13 SENSOR2.6 57.9,13 58.2,13.3 58.2,14.5 57.8,14.9 57.8,16.6 57.28,17.12 BD48E27G-TR.P$2 55.78,17.12 55.3,17.6 54.96,17.6 C2.1 54.77,20.03 v54.7,20.1 | U$1.P$2 49.28,13.21 R2-PINH.2 | U$6.VDD33 7.14,2.89 C1.1 9.23,0.8 40.2,0.8 43.5,4.1 v43.5,6.8 | SV1.13 48.05,26 46.5,24.45 MK1.8 45.5,25.2 45.3,25.4 42.7,25.4 42.5,25.6 MK1.4 41.55,26.35 41,25.8 v41,24.9 | R6.2 33.15,21.9 v33.8,21.9 34.75,22.85 35.12,22.85 35.18,22.9 36.66,22.9 37.11,23.36 37.68,23.36 U$2.P$1 39.17,24.32 39.3,24.2 v39.3,23.6 | v37.3,21.9 36.95,21.55 R4.2 | v44.1,21.73 43.92,21.55 R3.2 R5.2 39.35,21.55 39,21.2 39,18.9 37.7,17.6 37.7,14.2 37.2,13.7 37.2,8.3 v36.8,7.9 J3.P4 | SV2.9 SV2.8 | R2.2 85.2,19.7 v85.5,19.4
  Bottom 0.305: v33.8,21.9 v37.3,21.9 43.93,21.9 v44.1,21.73 | v41,24.9 40.6,24.9 v39.3,23.6 | v36.8,7.9 43.2,7.9 | 43.2,7.9 51.6,7.9 v51.9,7.6 | 43.2,7.9 43.5,7.6 v43.5,6.8 | v85.5,19.4 85.5,20.3 84.3,21.5 83.3,21.5 82.8,21 82.8,20.3 80.6,18.1 v71,18.1 60.6,18.1 58.6,20.1 v54.7,20.1
GND  (via drill 0.2, 0.35)  (1 unrouted)
  Top 0.15: v69.2,9.1 69.28,9.18 IC2.5 68.95,10 68.55,10.4 | IC2.3 68.55,10.4 | 68.55,10.4 IC2.9
  Top 0.305: MOLEX.5 89.5,15.3 88.75,16.05 C2_USB.2 | C3_BUS.2 89.93,9.13 90.7,9.9 MOLEX.SH1 | C1_BAT.2 68.01,17.11 68.2,17.3 68.2,17.93 R2_BAT.1 | 68.75,11.7 68.75,11.25 | 68.8,9.55 68.75,9.6 68.75,10.1
  other vias: 56.2,9 66.4,19.1 67.7,19.1 67.2,8.3 77.8,19.1 62.4,19.1 61.5,19.1 24.4,15.5 16.4,25.1 22,25.1 17,15.1 17,11.1 9.1,3.3 11.5,3.3 10.3,1.9 29.6,15.3 30.5,15.3 32.9,15.3 33.9,15.3 41.5,15.4 36.4,9.7 36.6,15.3 44.3,15.7 41.4,23.8 46.6,25.9 61.1,6.2 64.1,6.2 83.1,12.3 84.3,12.3 64.6,22.1 71.8,22.1 50.6,17.4 53.2,17.4 62.1,15.4 58.4,12.2 60.8,13.1 51.7,12.2 72.2,10.4 86.3,6.6 88.3,6.6 56.9,14.9 88,24.2 91.5,26.7 90.7,18.1 5.5,16.6 5.5,17.6 5.5,18.6 5.5,19.6 5.5,20.6 5.5,21.6 5.5,15.6 5.5,14.6 5.5,13.6 5.5,12.6 5.5,11.6 5.5,10.6 5.5,9.6 5.5,8.6 5.5,7.6 5.5,6.6 5.5,1.6 6.5,1.6 5.5,24.6 5.5,25.6 5.5,26.6 68.75,11.05 68.75,10.15 68.75,10.6
  pour Top (isolate 0.254): 5,28 95,28 95,0 5,0
  pour Bottom (isolate 0.254): 5,30 97,30 97,-2 5,-2
GPIO0  (via drill 0.35)
  Top 0.305: R1-ESP1.1 70.22,18.96 UMH3NFHATN.3 71.6,19.9 72.6,20.9 83.5,20.9 v83.9,20.5 83.9,22.3 84.93,23.33 92.93,23.33 93.6,24 93.6,24.7 MODE_BUTTON.4 MODE_BUTTON.3 | v23.1,9.4 22.38,10.12 U$6.IO0
  Bottom 0.305: v23.1,9.4 25.5,9.4 27.5,11.4 61.8,11.4 66.4,16 82.5,16 84.5,18 84.5,19.9 v83.9,20.5
GPIO2  (via drill 0.35)
  Top 0.305: U$6.IO2 23.65,9.74 23.73,9.66 23.73,9.14 23.7,9.11 v23.7,7.8 | v53.86,8.64 58.38,4.12 SV2.4
  Bottom 0.305: v23.7,7.8 28.1,7.8 28.94,8.64 v53.86,8.64
GPIO4  (via drill 0.35)
  Top 0.305: U$6.IO4 21.11,9.39 v22.6,7.9 | v81.4,22.2 74.5,22.2 73.62,23.08 SV1.4
  Bottom 0.305: v22.6,7.9 23.3,8.6 25.7,8.6 27.9,10.8 62.1,10.8 66.5,15.2 82.9,15.2 86.5,18.8 86.5,21 85.1,22.4 81.6,22.4 v81.4,22.2
GPIO12  (via drill 0.35)
  Top 0.305: U$6.IO12 22.4,4.98 v22.4,2.7
  Bottom 0.305: v22.4,2.7 40.6,2.7 42.7,4.8 59.7,4.8 60.92,3.58 SV2.5
GPIO13
  Top 0.305: U$6.IO13 25.12,5.2 25.12,14.22 30.4,19.5 30.4,24.9 30.8,25.3 31.8,25.3 32.3,24.8 R_G.2
GPIO14
  Top 0.305: R_R.2 30.7,26 29.8,25.1 29.8,19.8 24.5,14.5 24.5,7.4 24,6.9 21.8,6.9 21.11,6.21 U$6.IO14
GPIO15  (via drill 0.35)
  Top 0.305: R_B.2 32.4,23.6 v32.1,23.3 | v24.9,24.7 24.92,24.68 U$6.IO15
  Bottom 0.305: v32.1,23.3 31.5,22.7 26,22.7 24.9,23.8 v24.9,24.7
GPIO25  (via drill 0.35)
  Top 0.305: MK1.6 v43.5,23.53 | SV1.5 71.1,25.98 71.1,24.3 70.7,23.9 64.2,23.9 61.33,21.03 46.8,21.03 v46.1,21.73 46.1,16.2 42,12.1 42,3.8 40,1.8 22.1,1.8 20.8,3.1 17.8,3.1 17.3,3.6 U$6.IO25
  Bottom 0.305: v46.1,21.73 46.1,23 44.5,24.6 43.9,24.6 43.5,24.2 v43.5,23.53
GPIO26  (via drill 0.35)
  Top 0.305: MK1.7 v44.5,23.53 58.97,23.53 v59.4,23.1 | v31.83,21.8 31.83,19.13 26.5,13.8 v26.5,11.7 | v18.6,6.5 18.6,5.03 U$6.IO26 | v79.6,18.9 79.6,17.64 79.14,17.19 79.14,13.45 v78.6,12.9
  Bottom 0.305: v44.5,23.53 44.39,23.53 43.76,22.9 32.93,22.9 v31.83,21.8 | v26.5,11.7 26.1,11.3 23.9,11.3 19.1,6.5 v18.6,6.5 | v79.6,18.9 78.4,20.1 68.1,20.1 65.1,23.1 v59.4,23.1 | v78.6,12.9 66.9,12.9 65.3,11.3 65.3,4.8 63.6,3.1 63.5,3.1 63.46,3.06 SV2.6
GPIO27  (via drill 0.35)
  Top 0.305: MK1.3 v43.5,27.3 | v31.1,24.5 31.1,19.3 25.8,14 v25.8,12.3 | v20,8.7 20,5.16 U$6.IO27 | v59.7,24.2 48.5,24.2 v48,24.7 | v79.7,12.9 79.7,16.7 80.4,17.4 v80.4,19.5
  Bottom 0.305: v31.1,24.5 33.1,26.5 42.7,26.5 v43.5,27.3 46.7,27.3 48,26 v48,24.7 | v25.8,12.3 23.6,12.3 v20,8.7 | SV2.7 66,11.1 67,12.1 79.7,12.1 v79.7,12.9 | v80.4,19.5 78.8,21.1 68,21.1 65.2,23.9 60.2,23.9 59.9,24.2 v59.7,24.2
GPIO32  (via drill 0.35)
  Top 0.305: U$6.IO32 14.76,3.44 v14.8,3.4
  Bottom 0.305: v14.8,3.4 16.3,4.9 40.3,4.9 41.4,6 58.2,6 66.6,14.4 83.3,14.4 87.2,18.3 87.2,21.5 85.7,23 67,23 66,24 SV1.7
GPIO33  (via drill 0.35)
  Top 0.305: U$6.IO33 16.1,4.93 v16.1,3.6
  Bottom 0.305: v16.1,3.6 40.3,3.6 42.1,5.4 58.5,5.4 66.78,13.68 81.79,13.68 81.87,13.6 83.9,13.6 87.9,17.6 87.9,22 86.1,23.8 69.2,23.8 68.54,24.46 SV1.6
GPIO34  (via drill 0.35)
  Top 0.305: U$6.IO34 12.22,7.28 v12.2,7.3 | R7-ESP1.2 59.66,15.16 58.91,14.41 R6-ESP1.1 v58.9,13.1
  Bottom 0.305: v12.2,7.3 16.7,7.3 16.8,7.2 17.1,7.2 23.2,13.3 26.5,13.3 27.7,12.1 46.5,12.1 47.8,13.4 58.9,13.4 v58.9,13.1
GPIO35  (via drill 0.35)
  Top 0.305: U$6.IO35 v13.49,3.41 v13.5,3.4
  Bottom 0.305: SV2.3 55.84,3.36 55.1,4.1 43.1,4.1 40.7,1.7 22,1.7 21.2,2.5 13.8,2.5 13.5,2.8 v13.5,3.4
MISO
  Top 0.305: J3.P7 33.5,13.3 31.3,15.5 31.3,17.8 32.2,18.7 D2.2 32.95,20.1 R6.1 33.65,20.25 35.4,22 35.4,22.1 35.7,22.4 36.8,22.4 37.3,22.9 40.1,22.9 | U$6.IO19 14.76,25.56 16.2,27 39.3,27 40.1,26.2 40.1,22.9 | SV1.9 60.92,22.92 60.3,22.3 48.2,22.3 47.6,22.9 40.1,22.9
MOSI  (via drill 0.35)
  Top 0.305: v41,20.3 40.9,20.3 40.85,20.25 R5.1 39.95,20.1 D3.2 39.95,18.05 40.5,17.5 40.5,16.1 40.1,15.7 38.7,15.7 38.3,15.3 38.3,13.9 37.9,13.5 J3.P3 | U$6.IO23 7.14,20.16 9.3,18 14.1,18 v15.6,19.5
  Bottom 0.305: SV1.10 58.4,25.98 58.4,24.2 57.4,23.2 56.1,23.2 53.2,20.3 v41,20.3 40.2,19.5 v15.6,19.5
N$2
  Top 0.2: IC2.6 IC2.7
  Top 0.254: IC2.7 IC2.8 69.58,11.2 69.8,10.97 69.8,10.8 | IC2.7 IC2.6 69.56,10.41 69.57,10.4 69.8,10.4 69.8,10.8 | IC2.7 69.8,10.8
  Top 0.406: D1.1 76.58,10.2 SI2347DS-T1-GE3.2 74.6,10.2 74,9.6 74,8.1 73.7,7.8 72.4,7.8 72,8.2 72,9.2 71.6,9.6 71.15,9.6 C1_BAT1.1 70.45,9.75 69.8,10.4
N$5
  Top 0.305: MCP73831.1 62.72,16.48 62.37,16.83 R1_BAT.1
N$6
  Top 0.305: CHG_LED.C 61.68,18.26 R1_BAT.2
N$7
  Top 0.305: R2_BAT.2 66.35,17.95 66.1,17.7 MCP73831.5
N$8
  Top 0.305: R_R.1 37.92,26 U$2.P$2
N$10
  Top 0.305: U$2.P$3 35.98,25.27 35.5,24.8 R_G.1
N$11
  Top 0.305: R_B.1 36.7,23.6 36.95,23.85 U$2.P$4
N$15
  Top 0.305: U4.14 U4.13 81.5,14.8 81.19,14.48 81.19,13.21 81.36,13.04 81.67,13.04 82.2,12.5 82.2,12.3 82,12.1 81.99,12.1 81.56,11.67 81.04,11.67 80.61,12.1 75.3,12.1 73.5,13.9 73.5,15.9 73.79,16.19 C6_USB.1 74.64,17.74 74.93,18.03 75.53,18.03 75.59,17.97 U4.3
N$17
  Top 0.305: R1.1 87.72,21.86 LED_TX.A
N$18
  Top 0.305: R2.1 85.35,21.86 LED_RX.A
N$20
  Top 0.305: U4.1 74.86,19.24 74.2,19.9 72.5,19.9 72.25,19.65 UMH3NFHATN.2 72.25,18.45 71.6,17.8 UMH3NFHATN.4
N$21
  Top 0.305: U4.17 83.54,17.34 84,17.8 86.2,17.8 87.6,19.2 88.5,19.2 88.9,19.6 LED_TX.C
N$23
  Top 0.305: U4.10 78.03,13.53 78.5,14 78.5,19.9 78.8,20.2 83.1,20.2 84.9,18.4 85.8,18.4 86.42,19.02 LED_RX.C
N$24
  Top 0.305: UMH3NFHATN.5 72.25,17.65 72.9,18.3 UMH3NFHATN.1 72.94,19 74.1,19 74.49,18.61 U4.2
R_USB_N
  Top 0.2: R6_USB.2 85.25,14.45 85.1,14.3 83,14.3 82.86,14.16 U4.12
R_USB_P
  Top 0.2: R5_USB.2 84.08,13.53 U4.11
RESET  (via drill 0.35)
  Top 0.305: R1-ESP.1 72.35,15.55 72.9,16.1 UMH3NFHATN.6 | R1-ESP.1 72.35,14.31 75.05,11.61 80.46,11.61 80.85,11.22 83.38,11.22 84.1,10.5 84.1,7.2 85.6,5.7 87.3,5.7 89.2,3.8 89.2,3.3 RESET_BUTTON.4 RESET_BUTTON.3 | U$6.EN v8.4,6.6 | v57.7,17.7 57.33,18.07 BD48E27G-TR.P$1 56.45,19.55 57.36,20.46 67.84,20.46 69.3,19 69.3,14.6 69.75,14.15 72.35,14.15 72.38,14.18 72.48,14.18 72.53,14.13 72.53,14.8 R1-ESP.1
  Bottom 0.305: v8.4,6.6 9.8,8 16.5,8 22.4,13.9 26.8,13.9 28,12.7 46.1,12.7 47.4,14 54.8,14 57.8,17 57.8,17.6 v57.7,17.7
RX0  (via drill 0.35)
  Top 0.305: U$6.RXD0 11.47,22.48 11.47,20.95 12.29,20.13 15.86,20.13 17.89,18.1 v18.6,18.1 | v83.4,18.8 82.96,19.24 U4.20
  Bottom 0.305: v18.6,18.1 41.2,18.1 41.7,18.6 58,18.6 59.9,16.7 81.3,16.7 v83.4,18.8
SCK  (via drill 0.35)
  Top 0.305: J3.P5 35.7,14.8 34.8,15.7 34.8,18.2 35.3,18.7 D4.2 36.35,20.1 R4.1 | R4.1 37.65,20.25 38.3,20.9 38.3,21.9 38.84,22.45 46.85,22.45 47.6,21.7 60.7,21.7 63.5,24.5 63.5,25.96 SV1.8 | U$6.IO18 16.03,21.17 v16.8,20.4 | v34.9,20.4 36.05,20.4 R4.1
  Bottom 0.305: v16.8,20.4 v34.9,20.4
SCL  (via drill 0.35)
  Top 0.305: SENSOR2.4 54.1,13.93 54.1,14.5 53.1,15.5 51.1,15.5 50.7,15.1 R2-PINH.1 | R2-PINH.1 | SV2.2 53.3,3 52.4,3.9 48.3,3.9 48,4.2 48,5.6 47.72,5.88 LED1.4 47.1,14.3 47.72,14.92 U$1.P$3 49.08,14.92 49.5,14.5 50.67,14.5 R2-PINH.1 | U$6.IO22 v8.41,21.11 v8.4,21.1
  Bottom 0.305: v8.4,21.1 8.4,17.8 9.5,16.7 46.8,16.7 48.45,15.05 U$1.P$3
SDA  (via drill 0.35)
  Top 0.305: R1_PINH.1 52.9,14.5 53.2,14.2 53.2,13.4 53.6,13 SENSOR2.3 55,13 55.2,13.2 55.2,14.3 53.34,16.16 49.75,16.16 U$1.P$4 48.45,16.65 46.2,14.4 46.2,4.8 46.42,4.58 LED1.6 47.1,4.2 49.3,2 SV2.1 | U$6.IO21 12.22,21.12 v12.2,21.1
  Bottom 0.305: v12.2,21.1 12.2,18.3 13.04,17.46 U$1.P$4
SS  (via drill 0.35)
  Top 0.305: J3.P2 39,11.1 43.3,15.4 43.3,18.65 D5.2 43.35,20 R3.1 44.45,20.25 44.7,20.5 v44.7,21.1 | U$6.IO5 17.3,21.2 v17.4,21.1
  Bottom 0.305: v17.4,21.1 v44.7,21.1 52.6,21.1 55.84,24.34 SV1.11
TX0  (via drill 0.35)
  Top 0.305: U$6.TXD0 9.68,19.42 10.3,18.8 v12.9,18.8 | U4.4 75.33,17.34 v75.27,17.4
  Bottom 0.305: v12.9,18.8 40.86,18.8 41.41,19.36 58.15,19.36 60.1,17.4 v75.27,17.4
USB_DATA_N
  Top 0.305: R6_USB.1 88,13.15 88.05,13.1 C1_USB.1 88.4,13.35 MOLEX.2
  Top 0.406: 87.9,13.15 C1_USB.1
USB_DATA_P
  Top 0.305: MOLEX.3 88.4,14 C2_USB.1 87.55,14.35 86.4,15.5 84.75,15.5 R5_USB.1
VIN_BAT  (via drill 0.35)
  Top 0.305: C2_BAT.1 73.44,10.9 v73.8,10.9
  Top 0.406: SI2347DS-T1-GE3.3 73.02,11.32 C2_BAT.1 72.9,11.88 72.17,12.61 66.09,12.61 64.12,14.58 MCP73831.3 63.48,14.6 62.7,14.6 62.21,14.11 R6-ESP1.2
  Bottom 0.305: v73.8,10.9 76.16,8.54 SV2.11
  Bottom 0.406: BT1.+ 86.5,12 85.4,10.9 85.4,8.9 84.3,7.8 81.6,7.8 78.5,10.9 v73.8,10.9
VIN_USB  (via drill 0.35)
  Top 0.305: CHG_LED.A 64.74,19.76 65.2,19.3 65.2,18.32 | 65.2,18.32 C4_USB.1 | 65.2,18.32 65.2,17.6 65.1,17.5 65.1,15.1 65.62,14.58 MCP73831.4 67.8,14.58 C1_BAT.1 68,14 68.78,13.22 72.7,13.22 74.86,11.05 77.75,11.05 78.07,10.73 R1_PWRUSB.2 | D1.2 78.7,6.08 SV2.12 | U4.15 81.17,16.07 80.6,15.5 80.6,12.8 81.1,12.3 v81.3,12.3 | v83.1,9.1 81.85,9.1 PFMF.050.2.1
  Top 0.406: PFMF.050.2.1 81.83,9.97 81.6,10.2 81.45,10.05 C5_USB.1 79.61,9.87 R1_PWRUSB.2 77.97,9.87 76.63,8.53 D1.2 75.27,8.15 SI2347DS-T1-GE3.1
  Bottom 0.305: v81.3,12.3 81.3,10.9 v83.1,9.1
VUSB
  Top 0.406: MOLEX.1 90.27,12.63 89.5,12.63 89.2,12.32 89.2,9.9 88.38,9.08 86.4,9.08 | 86.4,9.08 PFMF.050.2.2 | C3_BUS.1 86.61,8.19 86.4,8.4 86.3,8.4 86.3,8.98 86.4,9.08

### Text on the board
tSilk: 3V3 | GND | SS | MOSI | MISO | SCK | 32 | 33 | 25 | 4 | GND | GND | GND | IO0 | SDA | SCL | 35 | 2 | 12 | 26 | 27 | 3V3 | 3V3 | GND | BAT | 5V | GND | RST
silk_bottom: 5 | 23 | 19 | 18 | 32 | 33 | 13 | 4 | GND | 3V3 | 3V3 | GND | GND | GND | GND | GND | GND | SDA | SCL | 35 | 2 | 12 | 14 | 15 | 3V3 | 3V3 | GND | BAT | USB | GND